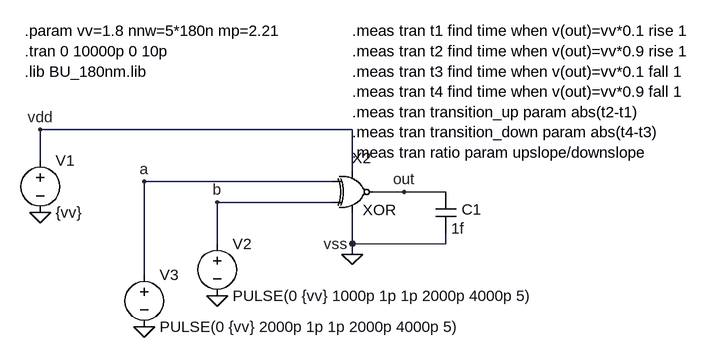
[diagram p0: schematic xor_test.asc]
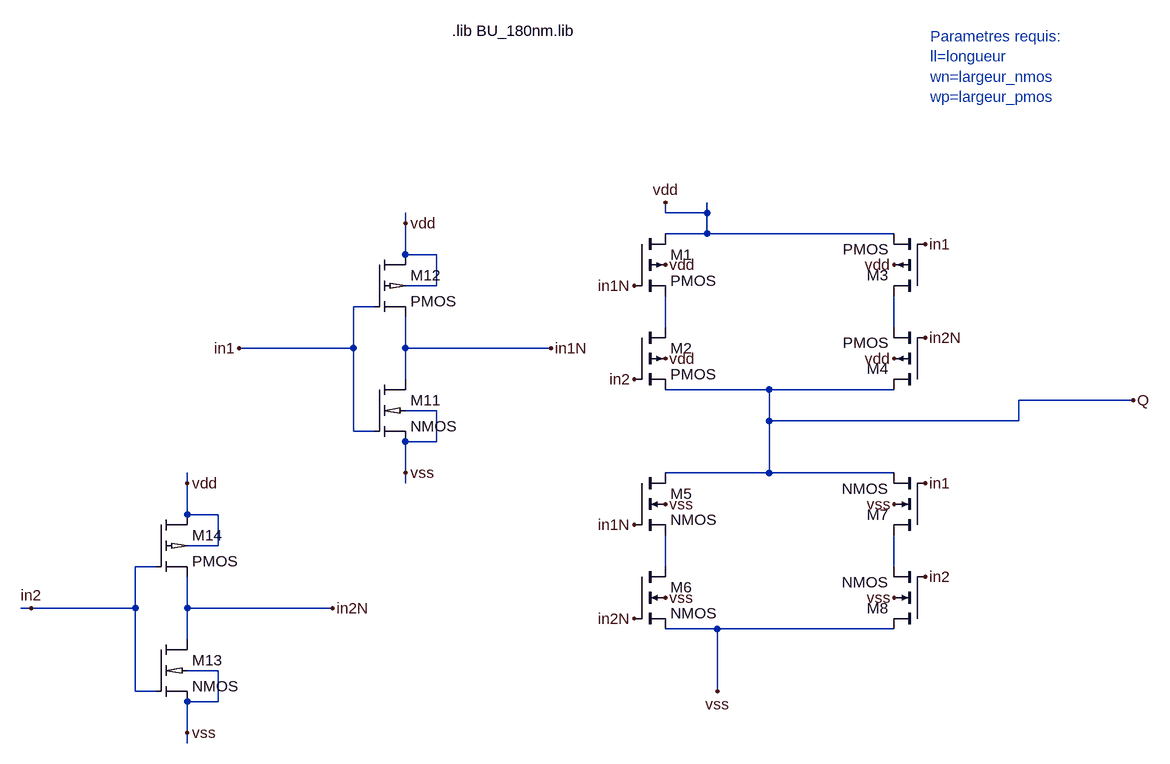
[diagram p1: sub-circuit xor.asc]
xor_test.asc, the LTspice schematic file:
Version 4
SHEET 1 1168 680
WIRE 416 224 -64 224
WIRE -64 272 -64 224
WIRE 416 288 416 224
WIRE 384 304 96 304
WIRE 496 320 448 320
WIRE 560 320 496 320
WIRE 384 336 208 336
WIRE 208 400 208 336
WIRE 416 400 416 352
WIRE 560 400 560 384
WIRE 560 400 416 400
WIRE 416 416 416 400
WIRE 96 448 96 304
FLAG -64 352 0
FLAG 208 480 0
FLAG 416 416 0
FLAG -64 224 vdd
FLAG 416 400 vss
FLAG 208 336 b
FLAG 496 320 out
FLAG 96 528 0
FLAG 96 304 a
SYMBOL /voltage -64 256 R0
SYMATTR InstName V1
SYMATTR Value {vv}
SYMBOL /voltage 208 384 R0
SYMATTR InstName V2
SYMATTR Value PULSE(0 {vv} 1000p 1p 1p 2000p 4000p 5)
SYMBOL xor 416 320 R0
SYMATTR InstName X2
SYMATTR SpiceLine ll=180n wn={nnw} wp={nnw*mp}
SYMBOL /voltage 96 432 R0
SYMATTR InstName V3
SYMATTR Value PULSE(0 {vv} 2000p 1p 1p 2000p 4000p 5)
SYMBOL cap 544 320 R0
WINDOW 0 40 27 Left 2
SYMATTR InstName C1
SYMATTR Value 1f
TEXT -88 72 Left 2 !.param vv=1.8 nnw=5*180n mp=2.21\n.tran 0 10000p 0 10p\n.lib BU_180nm.lib
TEXT 416 72 Left 2 !.meas tran t1 find time when v(out)=vv*0.1 rise 1\n.meas tran t2 find time when v(out)=vv*0.9 rise 1\n.meas tran t3 find time when v(out)=vv*0.1 fall 1\n.meas tran t4 find time when v(out)=vv*0.9 fall 1\n.meas tran transition_up param abs(t2-t1)\n.meas tran transition_down param abs(t4-t3)\n.meas tran ratio param upslope/downslope

xor.asc, the sub-circuit schematic file:
Version 4
SHEET 1 1192 964
WIRE 384 80 384 64
WIRE 448 80 448 64
WIRE 448 80 384 80
WIRE -16 96 -16 80
WIRE 448 112 448 80
WIRE 448 112 384 112
WIRE 736 112 448 112
WIRE -16 144 -16 96
WIRE 32 144 -16 144
WIRE 32 192 32 144
WIRE 32 192 -16 192
WIRE -64 224 -96 224
WIRE 384 256 384 208
WIRE 736 256 736 208
WIRE -96 288 -96 224
WIRE -96 288 -272 288
WIRE -16 288 -16 240
WIRE 208 288 -16 288
WIRE -16 336 -16 288
WIRE 544 352 384 352
WIRE 736 352 544 352
WIRE 1104 368 928 368
WIRE 32 384 -16 384
WIRE 544 400 544 352
WIRE 928 400 928 368
WIRE 928 400 544 400
WIRE -96 416 -96 288
WIRE -64 416 -96 416
WIRE 32 432 32 384
WIRE 32 432 -16 432
WIRE -16 480 -16 432
WIRE 544 480 544 400
WIRE 544 480 384 480
WIRE 736 480 544 480
WIRE -352 496 -352 480
WIRE -16 496 -16 480
WIRE -352 544 -352 496
WIRE -304 544 -352 544
WIRE -304 592 -304 544
WIRE -304 592 -352 592
WIRE -400 624 -432 624
WIRE 384 624 384 576
WIRE 736 624 736 576
WIRE -592 688 -608 688
WIRE -432 688 -432 624
WIRE -432 688 -592 688
WIRE -352 688 -352 640
WIRE -128 688 -352 688
WIRE 464 720 384 720
WIRE 736 720 464 720
WIRE -352 736 -352 688
WIRE -304 784 -352 784
WIRE -432 816 -432 688
WIRE -400 816 -432 816
WIRE 464 816 464 720
WIRE -304 832 -304 784
WIRE -304 832 -352 832
WIRE -352 880 -352 832
WIRE -352 896 -352 880
FLAG 336 192 in1N
FLAG 784 272 in2N
FLAG 464 816 vss
FLAG 384 64 vdd
FLAG 1104 368 Q
FLAG 336 560 in1N
FLAG 784 640 in2
FLAG 336 336 in2
FLAG 784 496 in1
FLAG 784 128 in1
FLAG 336 704 in2N
FLAG -272 288 in1
FLAG -16 96 vdd
FLAG -16 480 vss
FLAG 208 288 in1N
FLAG -352 496 vdd
FLAG -352 880 vss
FLAG -128 688 in2N
FLAG -592 688 in2
FLAG 384 160 vdd
FLAG 736 160 vdd
FLAG 736 304 vdd
FLAG 384 304 vdd
FLAG 736 672 vss
FLAG 736 528 vss
FLAG 384 528 vss
FLAG 384 672 vss
SYMBOL pmos4 336 112 R0
SYMATTR InstName M1
SYMATTR Value2 l={ll} w={2*wp} ad={450n*{wp}} as={450n*{wp}} pd={900n+{wp}} ps={1080n+{wp}}
SYMBOL pmos4 336 256 R0
SYMATTR InstName M2
SYMATTR Value2 l={ll} w={2*wp} ad={450n*{wp}} as={450n*{wp}} pd={900n+{wp}} ps={1080n+{wp}}
SYMBOL pmos4 784 208 R180
SYMATTR InstName M3
SYMATTR Value2 l={ll} w={2*wp} ad={450n*{wp}} as={450n*{wp}} pd={900n+{wp}} ps={1080n+{wp}}
SYMBOL pmos4 784 352 R180
SYMATTR InstName M4
SYMATTR Value2 l={ll} w={2*wp} ad={450n*{wp}} as={450n*{wp}} pd={900n+{wp}} ps={1080n+{wp}}
SYMBOL nmos4 336 480 R0
SYMATTR InstName M5
SYMATTR Value2 l={ll} w={2*wn} ad={450n*{wn}} as={450n*{wn}} pd={900n+{wn}} ps={1080n+{wn}}
SYMBOL nmos4 336 624 R0
SYMATTR InstName M6
SYMATTR Value2 l={ll} w={2*wn} ad={450n*{wn}} as={450n*{wn}} pd={900n+{wn}} ps={1080n+{wn}}
SYMBOL nmos4 784 576 R180
SYMATTR InstName M7
SYMATTR Value2 l={ll} w={2*wn} ad={450n*{wn}} as={450n*{wn}} pd={900n+{wn}} ps={1080n+{wn}}
SYMBOL nmos4 784 720 R180
SYMATTR InstName M8
SYMATTR Value2 l={ll} w={2*wn} ad={450n*{wn}} as={450n*{wn}} pd={900n+{wn}} ps={1080n+{wn}}
SYMBOL nmos018 -64 336 R0
SYMATTR InstName M11
SYMATTR Value2 l={ll} w={wn} ad={450n*{wn}} as={450n*{wn}} pd={900n+{wn}} ps={1080n+{wn}}
SYMBOL pmos018 -64 144 R0
SYMATTR InstName M12
SYMATTR Value2 l={ll} w={wp} ad={450n*{wp}} as={450n*{wp}} pd={900n+{wp}} ps={1080n+{wp}}
SYMBOL nmos018 -400 736 R0
SYMATTR InstName M13
SYMATTR Value2 l={ll} w={wn} ad={450n*{wn}} as={450n*{wn}} pd={900n+{wn}} ps={1080n+{wn}}
SYMBOL pmos018 -400 544 R0
SYMATTR InstName M14
SYMATTR Value2 l={ll} w={wp} ad={450n*{wp}} as={450n*{wp}} pd={900n+{wp}} ps={1080n+{wp}}
TEXT 56 -200 Left 2 !.lib BU_180nm.lib
TEXT 792 -192 Left 2 ;Parametres requis: \nll=longueur \nwn=largeur_nmos \nwp=largeur_pmos

The netlist it stands for:
* xor_test.asc
V1 vdd 0 {vv}
V2 b 0 PULSE(0 {vv} 1000p 1p 1p 2000p 4000p 5)
XX2 a out vdd 0 b xor params: XOR ll=180n wn={nnw} wp={nnw*mp}
V3 a 0 PULSE(0 {vv} 2000p 1p 1p 2000p 4000p 5)
C1 out 0 1f

* block symbol definitions
.subckt xor in1 Q vdd vss in2
M1 vdd in1N N001 vdd PMOS l={ll} w={2*wp} ad={450n*{wp}} as={450n*{wp}} pd={900n+{wp}} ps={1080n+{wp}}
M2 N001 in2 Q vdd PMOS l={ll} w={2*wp} ad={450n*{wp}} as={450n*{wp}} pd={900n+{wp}} ps={1080n+{wp}}
M3 N002 in1 vdd vdd PMOS l={ll} w={2*wp} ad={450n*{wp}} as={450n*{wp}} pd={900n+{wp}} ps={1080n+{wp}}
M4 Q in2N N002 vdd PMOS l={ll} w={2*wp} ad={450n*{wp}} as={450n*{wp}} pd={900n+{wp}} ps={1080n+{wp}}
M5 Q in1N N003 vss NMOS l={ll} w={2*wn} ad={450n*{wn}} as={450n*{wn}} pd={900n+{wn}} ps={1080n+{wn}}
M6 N003 in2N vss vss NMOS l={ll} w={2*wn} ad={450n*{wn}} as={450n*{wn}} pd={900n+{wn}} ps={1080n+{wn}}
M7 N004 in1 Q vss NMOS l={ll} w={2*wn} ad={450n*{wn}} as={450n*{wn}} pd={900n+{wn}} ps={1080n+{wn}}
M8 vss in2 N004 vss NMOS l={ll} w={2*wn} ad={450n*{wn}} as={450n*{wn}} pd={900n+{wn}} ps={1080n+{wn}}
M11 in1N in1 vss vss NMOS l={ll} w={wn} ad={450n*{wn}} as={450n*{wn}} pd={900n+{wn}} ps={1080n+{wn}}
M12 vdd in1 in1N vdd PMOS l={ll} w={wp} ad={450n*{wp}} as={450n*{wp}} pd={900n+{wp}} ps={1080n+{wp}}
M13 in2N in2 vss vss NMOS l={ll} w={wn} ad={450n*{wn}} as={450n*{wn}} pd={900n+{wn}} ps={1080n+{wn}}
M14 vdd in2 in2N vdd PMOS l={ll} w={wp} ad={450n*{wp}} as={450n*{wp}} pd={900n+{wp}} ps={1080n+{wp}}
.lib BU_180nm.lib
* Parametres requis:
* ll=longueur
* wn=largeur_nmos
* wp=largeur_pmos
.ends xor

.model NMOS NMOS
.model PMOS PMOS
.lib standard.mos
.param vv=1.8 nnw=5*180n mp=2.21
.tran 0 10000p 0 10p
.lib BU_180nm.lib
.meas tran t1 find time when v(out)=vv*0.1 rise 1
.meas tran t2 find time when v(out)=vv*0.9 rise 1
.meas tran t3 find time when v(out)=vv*0.1 fall 1
.meas tran t4 find time when v(out)=vv*0.9 fall 1
.meas tran transition_up param abs(t2-t1)
.meas tran transition_down param abs(t4-t3)
.meas tran ratio param upslope/downslope
.lib BU_180nm.lib
.backanno
.end

* Results of the author's LTspice run, read from the files saved beside the schematic
* Operating Point, zero values left out:
*   V(vdd) = 1.8 V
*   V(out) = 4.675 µV
*   I(V1) = -7.893 nA
*   Ix(x2:VDD) = 7.893 nA
*   Ix(x2:VSS) = -7.893 nA
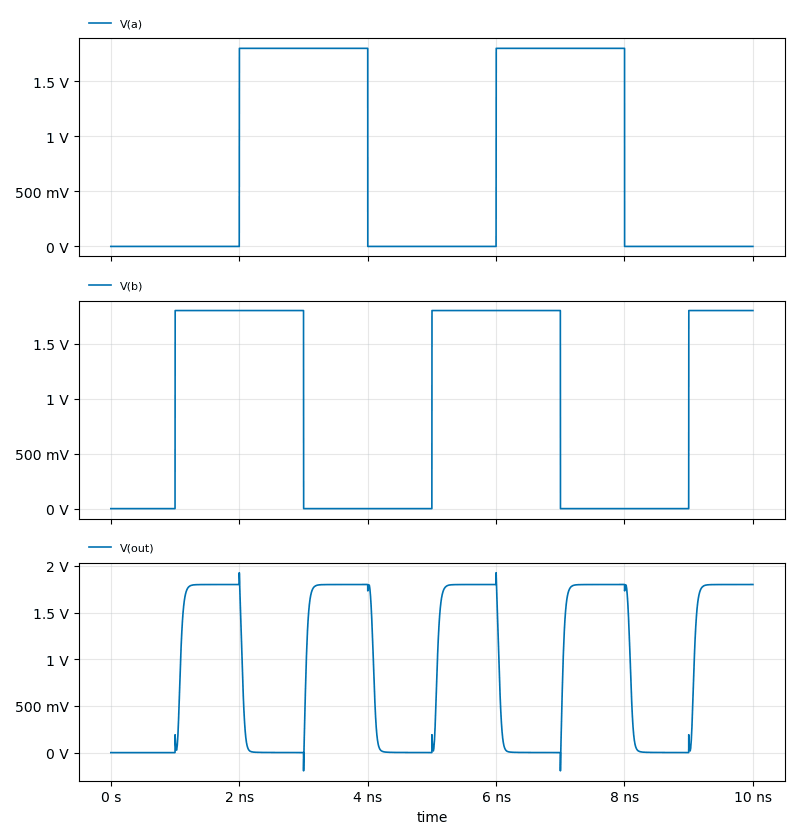
[diagram p2: Transient Analysis of xor_test.asc, plotted from the saved traces]
* Transient Analysis, 1 run:
*   V(a): min 0 V, max 1.8 V, average 720.4 mV, rms 1.139 V, last 0 V
*   V(b): min 0 V, max 1.8 V, average 900.3 mV, rms 1.273 V, last 1.8 V
*   V(out): min -195 mV, max 1.926 V, average 888.4 mV, rms 1.24 V, last 1.8 V
* From the log:
*   t1: time=1.00094e-009 at 1.00094e-009
*   t2: time=1.14337e-009 at 1.14337e-009
*   t3: time=1.00164e-009 at 1.00164e-009
*   t4: time=2.01486e-009 at 2.01486e-009
*   transition_up: abs(t2-t1)=1.42427e-010
*   transition_down: abs(t4-t3)=1.01322e-009
*   Measurement "ratio" FAIL'ed